# Altium schematic sheet PD_Controller.SchDoc
size A; SheetNumber: 2; SheetTotal: 5
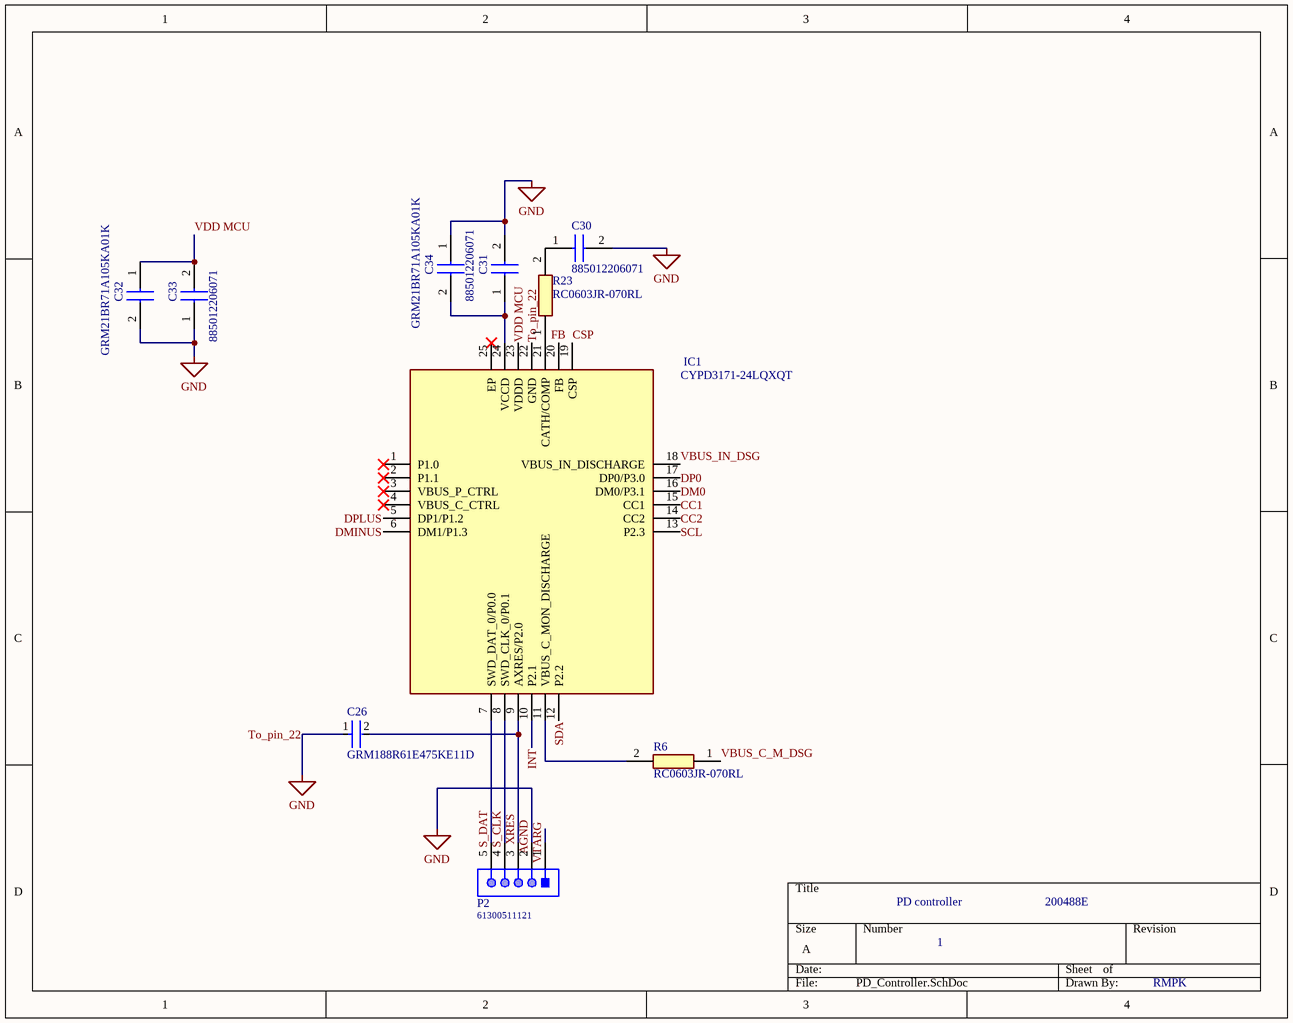
[diagram p0: PD_Controller.SchDoc]

## Parts
C26  GRM188R61E475KE11D  [FP-GRM188-0_15-IPC_C]
C30  885012206071  [CAPC1608X87N]
C31  885012206071  [CAPC1608X87N]
C32  GRM21BR71A105KA01K  [CAPC2012X145N]
C33  885012206071  [CAPC1608X87N]
C34  GRM21BR71A105KA01K  [CAPC2012X145N]
IC1  CYPD3171-24LQXQT  [QFN50P400X400X60-25N-D]
P2  61300511121  [61300511121]
R6  RC0603JR-070RL  [RESC1608X55N]
R23  RC0603JR-070RL  [RESC1608X55N]

## Nets
AGND: C26.1 C30.2 C31.2 C32.2 C33.1 C34.1 IC1.22(GND) P2.2  [also labelled GND, To_pin_22]
CC1: IC1.15(CC1)
CC2: IC1.14(CC2)
CSP: IC1.19(CSP)
DM0: IC1.16(DM0/P3.1)
DMINUS: IC1.6(DM1/P1.3)
DP0: IC1.17(DP0/P3.0)
DPLUS: IC1.5(DP1/P1.2)
FB: IC1.20(FB)
INT: IC1.10(P2.1)
S_CLK: IC1.8(SWD_CLK_0/P0.1) P2.4
S_DAT: IC1.7(SWD_DAT_0/P0.0) P2.5
SCL: IC1.13(P2.3)
SDA: IC1.12(P2.2)
VBUS_C_M_DSG: R6.1
VBUS_IN_DSG: IC1.18(VBUS_IN_DISCHARGE)
VDD MCU: C32.1 C33.2 IC1.23(VDDD)
VTARG: P2.1
XRES: C26.2 IC1.9(AXRES/P2.0) P2.3
NetC30_1: C30.1 R23.2
NetC31_1: C31.1 C34.2 IC1.24(VCCD)
NetIC1_11: IC1.11(VBUS_C_MON_DISCHARGE) R6.2
NetIC1_21: IC1.21(CATH/COMP) R23.1

Not connected (* = marked no-connect by the designer): IC1 1(P1.0)* 2(P1.1)* 3(VBUS_P_CTRL)* 4(VBUS_C_CTRL)* 25(EP)*

## Notes on the sheet
- PD controller
- 200488E
- 1
- RMPK

## Library data of the parts
C26 = CMP-2006-02523-2: Chip Multilayer Ceramic Capacitors for General Purpose, 0603, 4.7uF, X5R, 15%, 10%, 25V; Case Code (Metric): 1608; Max Operating Temperature: 85°C; REACH SVHC: No SVHC; Voltage Rating: 25V; Dielectric: X5R; Packaging: Cut Tape; Width: 0.031inch; Min Operating Temperature: -55°C; Lead Free: Lead Free; Capacitance: 4.7uF; Height: 0.8mm; Case Code (Imperial): 0603; Length: 1.6mm; Voltage Rating (DC): 25V; Case/Package: 0603; Voltage: 25V; Tolerance: 10%; Thickness: 0.031inch; Mount: Surface Mount; Material: Ceramic; Package Quantity: 4000; Depth: 0.8mm
C30 C31 C33 = 885012206071: Capacitor; Manufacturer_Name: Wurth Elektronik; Datasheet Link: https://katalog.we-online.com/pbs/datasheet/885012206071.pdf; Height: 0.87mm; Manufacturer_Part_Number: 885012206071; Mouser Part Number: 710-885012206071; Mouser Price/Stock: https://www.mouser.co.uk/ProductDetail/Wurth-Elektronik/885012206071?qs=0KOYDY2FL2%2FEBQkuHgvarg%3D%3D
C32 C34 = GRM21BR71A105KA01K: Capacitor; Manufacturer_Name: Murata Electronics; Datasheet Link: http://www.murata.com/~/media/webrenewal/support/library/catalog/products/capacitor/mlcc/c02e.pdf; Height: 1.45mm; Manufacturer_Part_Number: GRM21BR71A105KA01K; Mouser Part Number: 81-GRM40X105K10K; Mouser Price/Stock: https://www.mouser.co.uk/ProductDetail/Murata-Electronics/GRM21BR71A105KA01K?qs=Rc6BINVvJ%2FiXBniUY2d%2FOg%3D%3D; Arrow Part Number: GRM21BR71A105KA01K; Arrow Price/Stock: https://www.arrow.com/en/products/grm21br71a105ka01k/murata-manufacturing
IC1 = CYPD3171-24LQXQT: Integrated Circuit; Manufacturer_Name: Cypress Semiconductor; Datasheet Link: https://www.infineon.com/dgdl/Infineon-EZ-PD(TM)_CCG3PA_Datasheet_USB_Type-C_Port_Controller-DataSheet-v09_00-EN.pdf?fileId=8ac78c8c7d0d8da4017d0ee438366ac0; Height: 0.6mm; Manufacturer_Part_Number: CYPD3171-24LQXQT; Mouser Part Number: 727-CYPD3171-24LQXQT; Mouser Price/Stock: https://www.mouser.co.uk/ProductDetail/Cypress-Semiconductor/CYPD3171-24LQXQT?qs=%252BEew9%252B0nqrAzf6gHzBBxqw%3D%3D; Arrow Part Number: CYPD3171-24LQXQT; Arrow Price/Stock: https://www.arrow.com/en/products/cypd3171-24lqxqt/cypress-semiconductor
P2 = CMP-1502-01068-1: THT Vertical Pin Header WR-PHD, Pitch 2.54 mm, Single Row, 5 pins; Manufacturer: Wurth Elektronik; Pin Number: 5; Contact Resistance: 20mOhm; Working Voltage: 250VAC; Pitch: 2.54mm; Withstanding Voltage: 500VAC; Rated Current: 3A; Gender: Male; Datasheet URL: https://katalog.we-online.de/em/datasheet/6130xx11121.pdf; Orientation: Vertical; Mounting Technology: THT; Row Number: Single; Package Reference: 61300511121; Publisher: WurthElektronik; Part Number: 61300511121; Packaging: Bag; Manufacturer URL: http://www.we-online.de; Operating Temperature: -40to105degC
R6 R23 = RC0603JR-070RL: Resistor; Manufacturer_Name: YAGEO; Datasheet Link: https://componentsearchengine.com/Datasheets/2/RC0603JR-070RL.pdf; Height: 0.55mm; Manufacturer_Part_Number: RC0603JR-070RL; Mouser Part Number: 603-RC0603JR-070RL; Mouser Price/Stock: https://www.mouser.co.uk/ProductDetail/YAGEO/RC0603JR-070RL?qs=2cAdsCoAWRGWyPcuXgGiXQ%3D%3D; Arrow Part Number: RC0603JR-070RL; Arrow Price/Stock: https://www.arrow.com/en/products/rc0603jr-070rl/yageo?region=europe